# EAGLE design MicroSD_DataFlash_v03 (EAGLE 5.11)
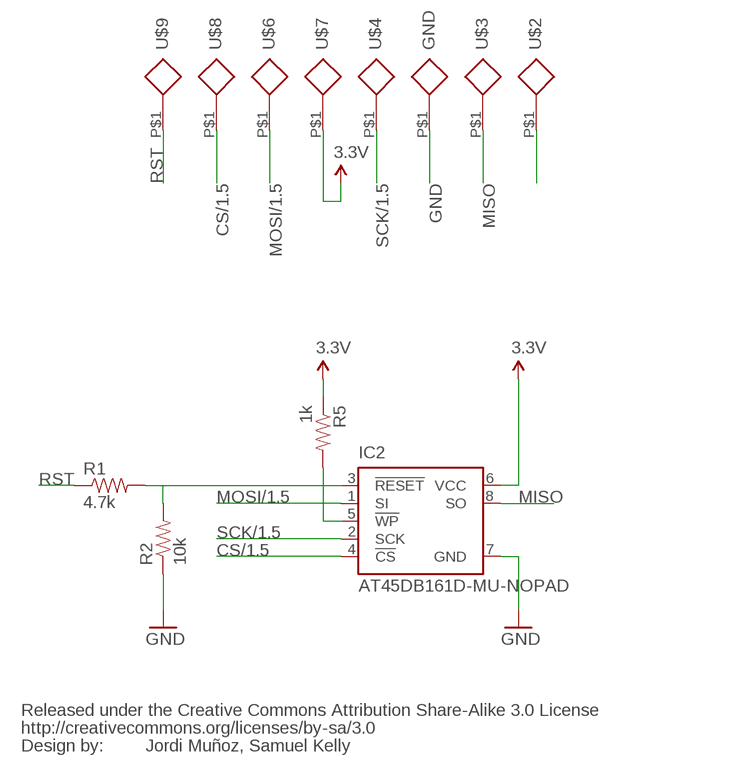
[diagram p0: schematic, sheet 1]

## Parts
GND  MICROSD-PAD3.2MM  [MICROSD-PAD-3.2MM]
IC2  AT45DB161D-MU-NOPAD  [VDFN-8-NO-BOTTOM-PAD]
R1  4.7k  RESISTOR0402-RES  [0402-RES]
R2  10k  RESISTOR0402-RES  [0402-RES]
R5  1k  RESISTOR0402-RES  [0402-RES]
U$1  CREATIVE_COMMONS  [CREATIVE_COMMONS]
U$2  MICROSD-PAD2.9MM  [MICROSD-PAD-2.9MM]
U$3  MICROSD-PAD2.9MM  [MICROSD-PAD-2.9MM]
U$4  MICROSD-PAD2.9MM  [MICROSD-PAD-2.9MM]
U$6  MICROSD-PAD2.9MM  [MICROSD-PAD-2.9MM]
U$7  MICROSD-PAD3.2MM  [MICROSD-PAD-3.2MM]
U$8  MICROSD-PAD2.9MM  [MICROSD-PAD-2.9MM]
U$9  MICROSD-PAD2.9MM  [MICROSD-PAD-2.9MM]

## Nets
3.3V: IC2.6(VCC) R5.1 U$7.P$1
CS/1.5: IC2.4(!CS) U$8.P$1
GND: GND.P$1 IC2.7(GND) R2.1
MISO: IC2.8(SO) U$3.P$1
MOSI/1.5: IC2.1(SI) U$6.P$1
N$2: IC2.3(!RESET) R1.2 R2.2
N$3: IC2.5(!WP) R5.2
N$11: U$2.P$1
RST: R1.1 U$9.P$1
SCK/1.5: IC2.2(SCK) U$4.P$1

## Notes on the sheet
- Jordi Muñoz, Samuel Kelly

## Library data of the parts
GND U$2-U$4 U$6-U$9 = 3DRobotics:MICROSD-PAD
IC2 = 3DRobotics:AT45DB161D: Atmel 16-megabit 2.5V or 2.7V DataFlash The Atmel® AT45DB161D is a 2.5V or 2.7V, serial-interface sequential access Flash memory ideally suited for a wide variety of digital voice-, image-, program code- and data-storage applications. The AT45DB161D supports Atmel RapidS? serial interface for applications requiring very high speed operations.; DATASHEET: http://www.atmel.com/dyn/resources/prod_documents/doc3500.pdf; LINK: http://www.atmel.com/dyn/products/product_card.asp?part_id=3772; MFGPN: AT45DB161D-MU
R1 R2 R5 = SparkFun:RESISTOR: Resistor Basic schematic elements and footprints for 0603, 1206, and PTH 1/10th watt (small) resistors.
U$1 = SparkFun:CREATIVE_COMMONS

## Board
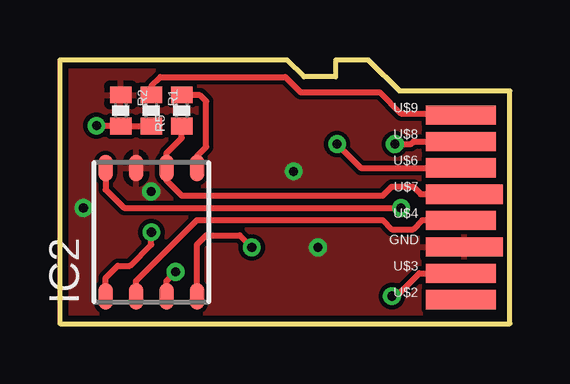
[diagram p1: board, top side]
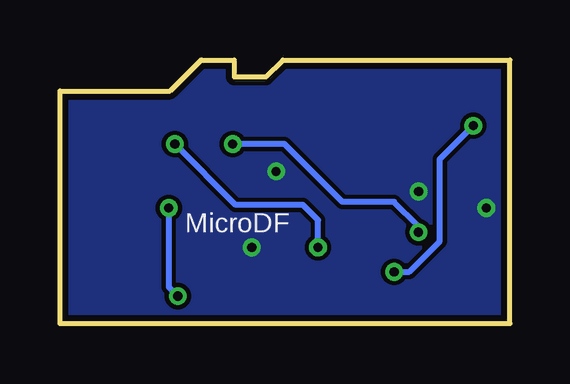
[diagram p2: board, bottom side, seen from below]

Size 18.76 x 11 mm. Coordinates in mm from the lower left corner, seen from the top.
Outline: 0,0 0,11 9.47,11 10.17,10.3 11.5,10.3 11.5,11 12.87,11 14.17,9.7 18.76,9.7 18.76,0 0,0
Copper layers (1*2+15*16): Top 0.035mm / dielectric 1.5mm / Route2 0.035mm / dielectric 0.15mm / Route15 0.035mm / dielectric 0.2mm / Bottom 0.035mm
Design rules "3DRobotics_4layers": minimum track width 7mil, minimum drill 15mil, track to track 7mil, track to pad 7mil, pad to pad 7mil, via to via 7mil, smd to smd 0mil, copper to edge 10mil, drill to drill 8mil, minimum pad ring 7mil, minimum via ring 7mil, stop-mask expansion 4mil, vias tented up to drill 25mil, thermal gap 10mil

### Footprints (pad centres in the part's own frame; a part is rotated, then mirrored left to right if it is on the bottom)
MICROSD-PAD-3.2MM = smd 0.8 x 3.2: P$1 0,0
VDFN-8-NO-BOTTOM-PAD = smd 1.1 x 0.6: 1 -2.675,1.905; 2 -2.675,0.635; 3 -2.675,-0.635; 4 -2.675,-1.905; 5 2.675,-1.905; 6 2.675,-0.635; 7 2.675,0.635; 8 2.675,1.905
0402-RES = smd 0.7 x 0.9: 1 -0.65,0; 2 0.65,0
MICROSD-PAD-2.9MM = smd 0.8 x 2.9: P$1 0,0

### Placement (x,y rotation side)
GND  16.87,3.2 90 top
IC2  3.81,3.81 90 top
R1  3.81,8.89 270 top
R2  2.54,8.89 270 top
R5  5.08,8.89 90 top
U$1  -20.57,-10.03 0 top  (outside the outline)
U$2  16.72,1 90 top
U$3  16.72,2.1 90 top
U$4  16.72,4.3 90 top
U$6  16.72,6.5 90 top
U$7  16.87,5.4 90 top
U$8  16.72,7.6 90 top
U$9  16.72,8.7 90 top

### Tracks (layer width: path | path; a pad name or v marks a point on that pad's centre or on a via)
3.3V
  Top 0.254: R5.1 5.08,7.75 4.45,7.11 IC2.6 4.45,5.97 5.08,5.33 13.46,5.33 13.84,5.71 14.73,5.71 15.05,5.4 U$7.P$1
CS/1.5  (via drill 0.38)
  Top 0.254: U$8.P$1 14.75,7.6 14.64,7.49 v13.97,7.49 | IC2.4 5.71,3.3 6.1,3.68 7.49,3.68 v8,3.17
  Bottom 0.254: v8,3.17 8,4.32 8.64,4.95 11.43,4.95 v13.97,7.49
GND  (via drill 0.38)
  other vias: 9.74,6.35 0.98,4.83 10.76,3.17 3.8,5.51
  pour Top: 0,0 0,12.7 19.51,12.7 19.51,0
  pour Bottom: 0,0 0,13.97 19.51,13.97 19.51,0
MISO  (via drill 0.38)
  Top 0.254: v13.84,1.14 14.03,1.14 14.99,2.1 U$3.P$1 | IC2.8 1.91,5.59 2.67,4.83 v14.22,4.83
  Bottom 0.254: v14.22,4.83 14.22,1.52 v13.84,1.14
MOSI/1.5  (via drill 0.38)
  Top 0.254: U$6.P$1 12.55,6.5 v11.56,7.49 | IC2.1 1.91,1.91 2.41,2.41 2.92,2.41 3.81,3.3 v3.81,3.81
  Bottom 0.254: v11.56,7.49 9.4,7.49 6.99,5.08 4.83,5.08 3.81,4.06 v3.81,3.81
N$2  (via drill 0.38)
  Top 0.254: R1.2 R2.2 2.52,8.26 v1.52,8.26 | IC2.3 4.45,1.78 v4.83,2.16
  Bottom 0.254: v4.83,2.16 4.19,2.16 2.92,3.43 2.92,6.86 v1.52,8.26
N$3
  Top 0.254: IC2.5 5.71,6.99 6.1,7.37 6.1,9.27 5.84,9.53 5.09,9.53 R5.2
RST
  Top 0.254: R1.1 3.81,9.9 4.19,10.29 9.4,10.29 10.03,9.65 13.34,9.65 14.22,8.76 16.66,8.76 U$9.P$1
SCK/1.5
  Top 0.254: IC2.2 3.17,1.78 5.71,4.32 13.46,4.32 13.84,3.94 14.73,3.94 15.11,4.32 16.7,4.32 U$4.P$1

### Text on the board
bPlace: MicroDF
tDocu: Jordi Muñoz, Samuel Kelly